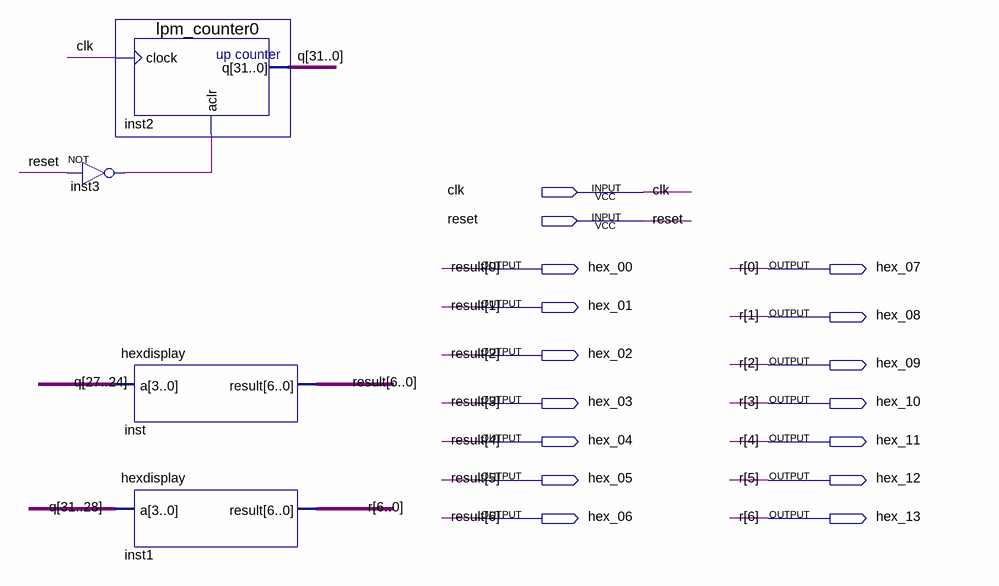
[diagram p0: schematic sheet]
// Quartus schematic task1display.bdf as structural Verilog: 4 symbols, 16 pins
module task1display (
  input  clk,
  input  reset,
  output hex_00,
  output hex_07,
  output hex_01,
  output hex_08,
  output hex_02,
  output hex_09,
  output hex_03,
  output hex_10,
  output hex_04,
  output hex_11,
  output hex_05,
  output hex_12,
  output hex_06,
  output hex_13
);

  wire inst3_out;
  wire [31:0] q;

  not inst3 (inst3_out, reset);
  lpm_counter0 inst2 (.clock(clk), .aclr(inst3_out), .q(q));
  hexdisplay inst (.a(q[27:24]), .result({hex_06, hex_05, hex_04, hex_03, hex_02, hex_01, hex_00}));
  hexdisplay inst1 (.a(q[31:28]), .result({hex_13, hex_12, hex_11, hex_10, hex_09, hex_08, hex_07}));

  // Other names for the same wires on the sheet: r[6:0] = {hex_13, hex_12, hex_11, hex_10, hex_09, hex_08, hex_07};
  //   result[6:0] = {hex_06, hex_05, hex_04, hex_03, hex_02, hex_01, hex_00}
endmodule
